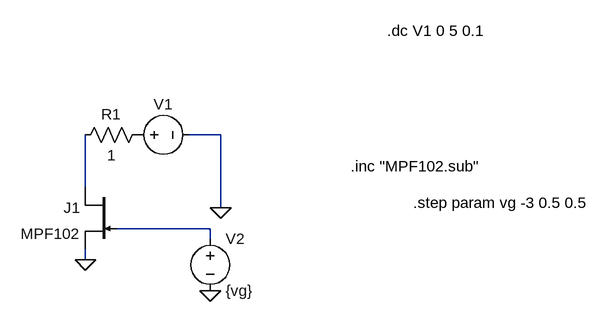
[diagram p0: schematic Curvas_FET.asc]
Curvas_FET.asc, the LTspice schematic file:
Version 4
SHEET 1 960 680
WIRE 368 -64 320 -64
WIRE 160 16 160 -64
WIRE 368 48 368 -64
WIRE 352 80 208 80
WIRE 352 96 352 80
WIRE 160 128 160 112
FLAG 352 176 0
FLAG 368 48 0
FLAG 160 128 0
SYMBOL njf 208 16 M0
SYMATTR InstName J1
SYMATTR Value MPF102
SYMBOL voltage 352 80 R0
WINDOW 123 0 0 Left 2
WINDOW 39 0 0 Left 2
SYMATTR InstName V2
SYMATTR Value {vg}
SYMBOL voltage 224 -64 R270
WINDOW 0 32 56 VTop 2
WINDOW 3 -32 56 VBottom 2
SYMATTR InstName V1
SYMATTR Value ""
SYMBOL res 256 -80 R90
WINDOW 0 0 56 VBottom 2
WINDOW 3 32 56 VTop 2
SYMATTR InstName R1
SYMATTR Value 1
TEXT 624 -224 Left 2 !.dc V1 0 5 0.1
TEXT 664 40 Left 2 !.step param vg -3 0.5 0.5
TEXT 568 -16 Left 2 !.inc "MPF102.sub"

The netlist it stands for:
* Curvas_FET.asc
J1 N001 N002 0 MPF102
V2 N002 0 {vg}
V1 P001 0
R1 P001 N001 1
.model NJF NJF
.model PJF PJF
.lib standard.jft
.dc V1 0 5 0.1
.step param vg -3 0.5 0.5
.inc "MPF102.sub"
.backanno
.end